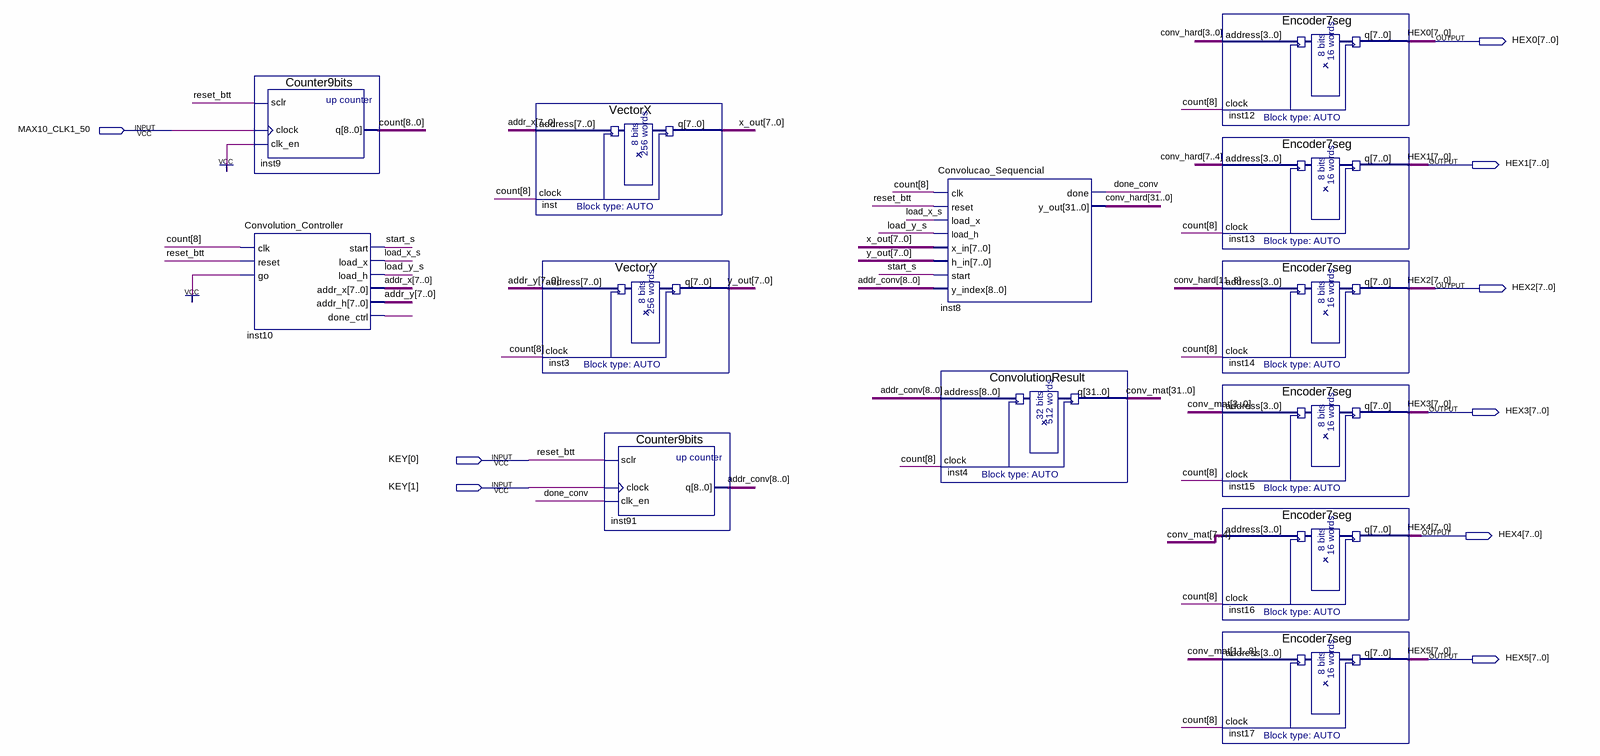
[diagram p0: schematic sheet]
// Quartus schematic ConvolutionHardware.bdf as structural Verilog: 13 symbols, 9 pins
module ConvolutionHardware (
  input  MAX10_CLK1_50,
  input  [1:0] KEY,
  output [7:0] HEX0,
  output [7:0] HEX1,
  output [7:0] HEX2,
  output [7:0] HEX3,
  output [7:0] HEX4,
  output [7:0] HEX5
);

  wire done_conv, inst10_done_ctrl, load_x_s, load_y_s, start_s;
  wire [7:0] addr_x, addr_y, x_out, y_out;
  wire [8:0] addr_conv, count;
  wire [31:0] conv_hard, conv_mat;

  Counter9bits inst9 (.sclr(KEY[0]), .clock(MAX10_CLK1_50), .clk_en(1'b1), .q(count));
  Convolution_Controller inst10 (
    .clk(count[8]), .reset(KEY[0]), .go(1'b1), .start(start_s), .load_x(load_x_s), .load_h(load_y_s),
    .addr_x(addr_x), .addr_h(addr_y), .done_ctrl(inst10_done_ctrl));
  VectorX inst (.address(addr_x), .clock(count[8]), .q(x_out));
  VectorY inst3 (.address(addr_y), .clock(count[8]), .q(y_out));
  Counter9bits inst91 (.sclr(KEY[0]), .clock(KEY[1]), .clk_en(done_conv), .q(addr_conv));
  Convolucao_Sequencial inst8 (
    .clk(count[8]), .reset(KEY[0]), .load_x(load_x_s), .load_h(load_y_s), .x_in(x_out), .h_in(y_out),
    .start(start_s), .y_index(addr_conv), .done(done_conv), .y_out(conv_hard));
  ConvolutionResult inst4 (.address(addr_conv), .clock(count[8]), .q(conv_mat));
  Encoder7seg inst12 (.address(conv_hard[3:0]), .clock(count[8]), .q(HEX0));
  Encoder7seg inst13 (.address(conv_hard[7:4]), .clock(count[8]), .q(HEX1));
  Encoder7seg inst14 (.address(conv_hard[11:8]), .clock(count[8]), .q(HEX2));
  Encoder7seg inst15 (.address(conv_mat[3:0]), .clock(count[8]), .q(HEX3));
  Encoder7seg inst16 (.address(conv_mat[7:4]), .clock(count[8]), .q(HEX4));
  Encoder7seg inst17 (.address(conv_mat[11:8]), .clock(count[8]), .q(HEX5));

  // Other names for the same wires on the sheet: reset_btt = KEY[0]
endmodule
